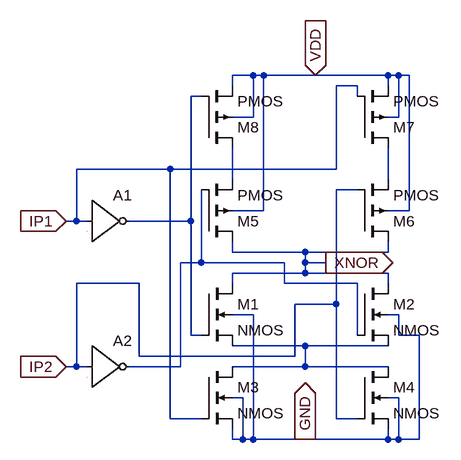
[diagram p0: schematic XNOR.asc]
XNOR.asc, the LTspice schematic file:
Version 4
SHEET 1 1196 680
WIRE 96 -208 64 -208
WIRE 112 -208 96 -208
WIRE 192 -208 112 -208
WIRE 304 -208 192 -208
WIRE 320 -208 304 -208
WIRE 336 -208 320 -208
WIRE 64 -192 64 -208
WIRE 256 -192 224 -192
WIRE 304 -192 304 -208
WIRE 16 -176 0 -176
WIRE 256 -176 256 -192
WIRE 96 -144 96 -208
WIRE 96 -144 64 -144
WIRE 320 -144 320 -208
WIRE 320 -144 304 -144
WIRE -32 -64 -176 -64
WIRE 224 -64 224 -192
WIRE 224 -64 -32 -64
WIRE 64 -48 64 -96
WIRE 304 -48 304 -96
WIRE 256 -32 224 -32
WIRE 112 0 112 -208
WIRE 112 0 64 0
WIRE 336 0 336 -208
WIRE 336 0 304 0
WIRE -176 16 -176 -64
WIRE -176 16 -192 16
WIRE -160 16 -176 16
WIRE 0 16 0 -176
WIRE 0 16 -96 16
WIRE 64 64 64 48
WIRE 176 64 64 64
WIRE 304 64 304 48
WIRE 304 64 176 64
WIRE 16 80 16 -32
WIRE 16 80 -16 80
WIRE 144 80 16 80
WIRE 176 80 176 64
WIRE 208 80 176 80
WIRE 176 96 176 80
WIRE 176 96 64 96
WIRE 304 96 176 96
WIRE -80 112 -176 112
WIRE 64 112 64 96
WIRE 144 112 144 80
WIRE 256 112 144 112
WIRE 304 112 304 96
WIRE 224 144 224 -32
WIRE 224 144 160 144
WIRE 96 160 64 160
WIRE 320 160 304 160
WIRE 0 192 0 16
WIRE 16 192 0 192
WIRE 256 192 256 112
WIRE 320 192 320 160
WIRE 352 192 320 192
WIRE 176 208 64 208
WIRE 304 208 176 208
WIRE -80 224 -80 112
WIRE 160 224 160 144
WIRE 160 224 -80 224
WIRE -176 240 -176 112
WIRE -176 240 -192 240
WIRE -160 240 -176 240
WIRE -16 240 -16 80
WIRE -16 240 -96 240
WIRE 176 240 176 208
WIRE 176 240 64 240
WIRE 304 240 176 240
WIRE 80 288 64 288
WIRE 320 288 304 288
WIRE -32 320 -32 -64
WIRE 16 320 -32 320
WIRE 224 320 224 144
WIRE 256 320 224 320
WIRE 64 352 64 336
WIRE 80 352 80 288
WIRE 80 352 64 352
WIRE 96 352 96 160
WIRE 96 352 80 352
WIRE 176 352 96 352
WIRE 304 352 304 336
WIRE 304 352 176 352
WIRE 320 352 320 288
WIRE 320 352 304 352
WIRE 352 352 352 192
WIRE 352 352 320 352
FLAG 176 352 GND
IOPIN 176 352 Out
FLAG -192 16 IP1
IOPIN -192 16 In
FLAG -192 240 IP2
IOPIN -192 240 In
FLAG 208 80 XNOR
IOPIN 208 80 Out
FLAG 192 -208 VDD
IOPIN 192 -208 In
SYMBOL nmos4 16 112 R0
SYMATTR InstName M1
SYMBOL nmos4 256 112 R0
SYMATTR InstName M2
SYMBOL nmos4 16 240 R0
SYMATTR InstName M3
SYMBOL nmos4 256 240 R0
SYMATTR InstName M4
SYMBOL pmos4 16 48 M180
SYMATTR InstName M5
SYMBOL pmos4 256 48 M180
SYMATTR InstName M6
SYMBOL pmos4 256 -96 M180
SYMATTR InstName M7
SYMBOL pmos4 16 -96 M180
SYMATTR InstName M8
SYMBOL Digital\\inv -160 -48 R0
SYMATTR InstName A1
SYMBOL Digital\\inv -160 176 R0
SYMATTR InstName A2

The netlist it stands for:
* XNOR.asc
M1 XNOR N001 N005 GND NMOS
M2 XNOR N004 N005 GND NMOS
M3 N005 IP1 GND GND NMOS
M4 N005 IP2 GND GND NMOS
M5 XNOR N004 N002 VDD PMOS
M6 XNOR IP2 N003 VDD PMOS
M7 N003 IP1 VDD VDD PMOS
M8 N002 N001 VDD VDD PMOS
A1 IP1 0 0 0 0 N001 0 0 BUF
A2 IP2 0 0 0 0 N004 0 0 BUF
.model NMOS NMOS
.model PMOS PMOS
.lib standard.mos
.backanno
.end